# EAGLE design adc (EAGLE 9.3.0)
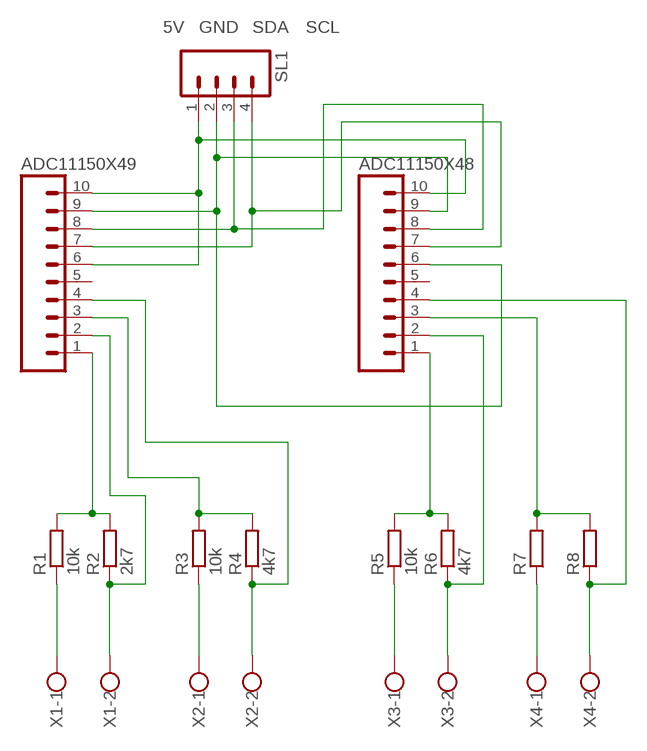
[diagram p0: schematic, sheet 1]

## Parts
ADC11150X48  M10  [10P]
ADC11150X49  M10  [10P]
R1  10k  R-EU_0204/7  [0204/7]
R2  2k7  R-EU_0204/7  [0204/7]
R3  10k  R-EU_0204/7  [0204/7]
R4  4k7  R-EU_0204/7  [0204/7]
R5  10k  R-EU_0204/7  [0204/7]
R6  4k7  R-EU_0204/7  [0204/7]
R7  R-EU_0204/7  [0204/7]
R8  R-EU_0204/7  [0204/7]
SL1  M04  [04P]
X1  W237-102  [W237-102]
X2  W237-102  [W237-102]
X3  W237-102  [W237-102]
X4  W237-102  [W237-102]

## Nets
5V: ADC11150X48.10 ADC11150X49.6 ADC11150X49.10 SL1.1
GND: ADC11150X48.6 ADC11150X48.9 ADC11150X49.9 SL1.2
N$1: ADC11150X48.1 R5.2 R6.2
N$2: R1.1 X1.1
N$3: ADC11150X48.2 R6.1 X3.2
N$4: ADC11150X48.3 R7.2 R8.2
N$5: R3.1 X2.1
N$6: ADC11150X48.4 R8.1 X4.2
N$7: R5.1 X3.1
N$8: R7.1 X4.1
N$9: ADC11150X49.1 R1.2 R2.2
N$10: ADC11150X49.2 R2.1 X1.2
N$13: ADC11150X49.3 R3.2 R4.2
N$14: ADC11150X49.4 R4.1 X2.2
SCL: ADC11150X48.7 ADC11150X49.7 SL1.4
SDA: ADC11150X48.8 ADC11150X49.8 SL1.3
Unconnected: ADC11150X48.5 ADC11150X49.5

## Library data of the parts
ADC11150X48 ADC11150X49 = con-amp-quick:M10: AMP QUICK CONNECTOR; OC_FARNELL: unknown; OC_NEWARK: unknown
R1-R8 = rcl:R-EU_: RESISTOR, European symbol; SPICEPREFIX: R
SL1 = con-amp-quick:M04: AMP QUICK CONNECTOR; OC_FARNELL: unknown; OC_NEWARK: unknown
X1-X4 = con-wago-500:W237-102: WAGO SCREW CLAMP; MPN: 237-102; OC_FARNELL: unknown; OC_NEWARK: 70K9898

## Board
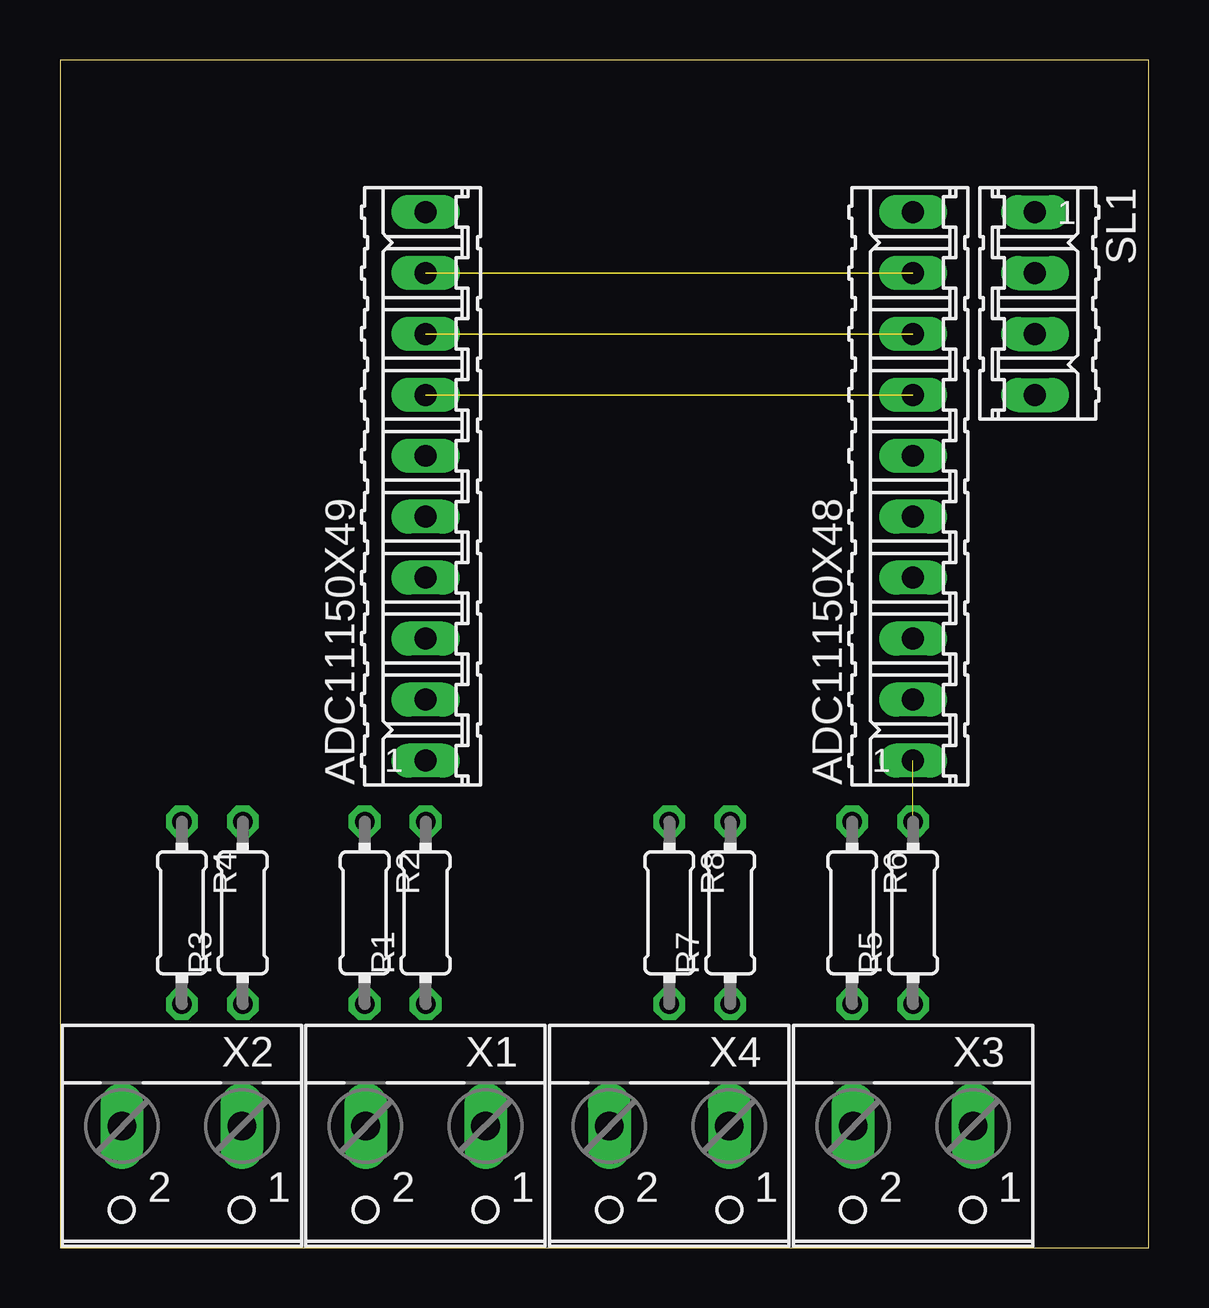
[diagram p1: board, top side]
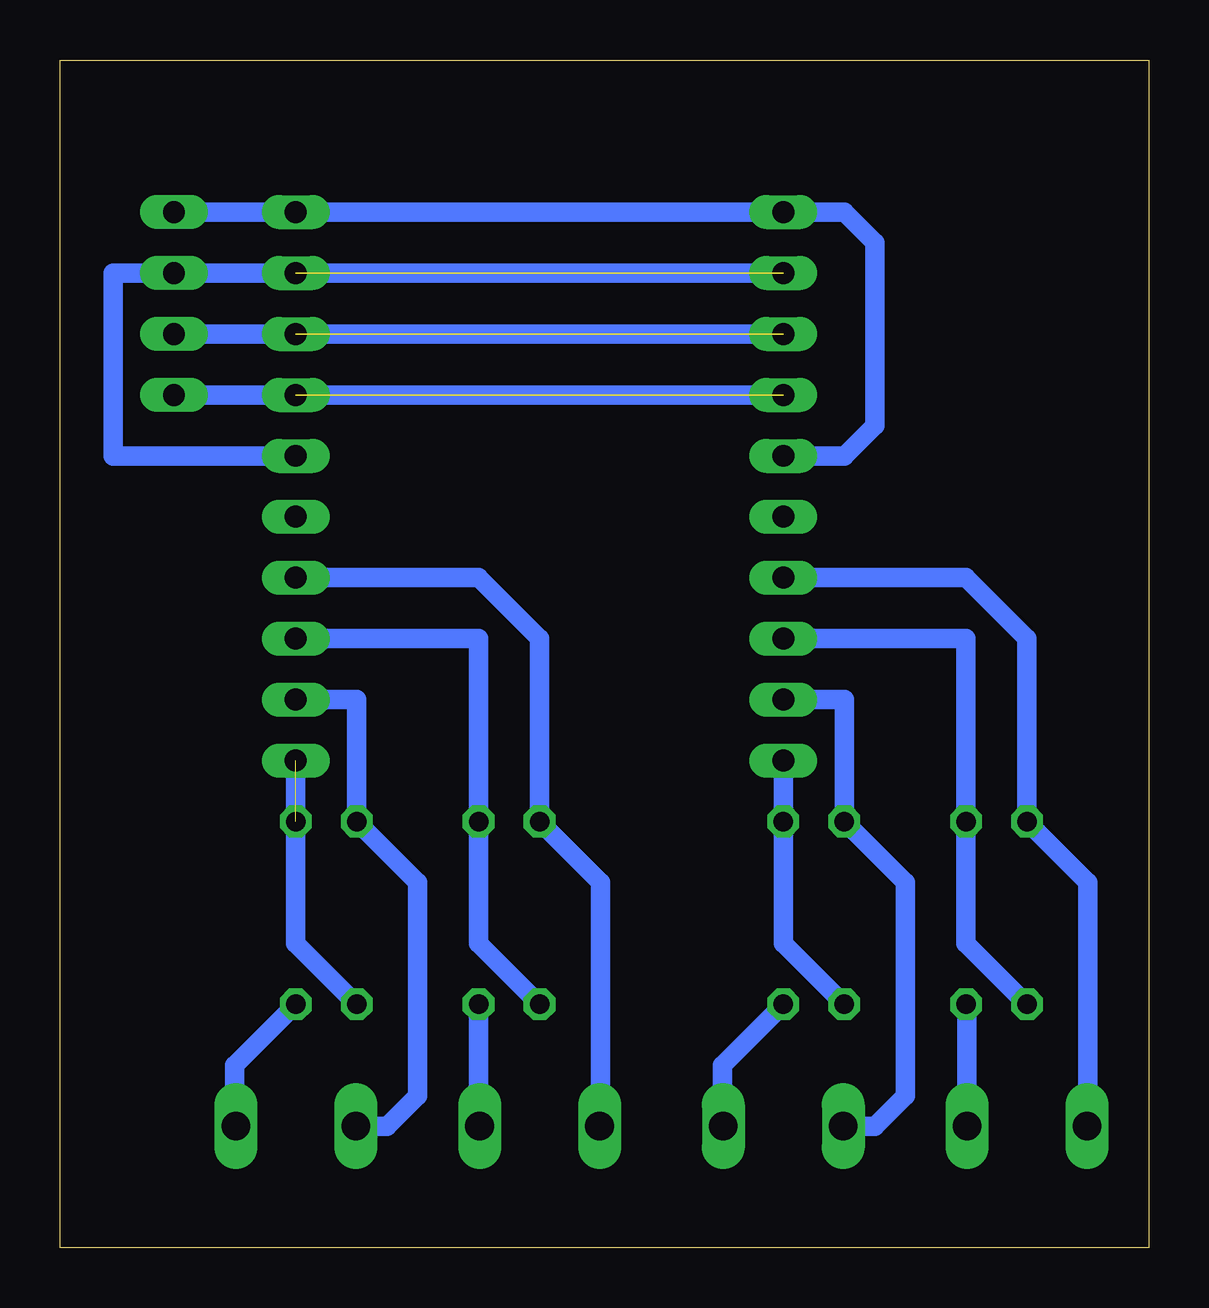
[diagram p2: board, bottom side, seen from below]

Size 45.39 x 49.52 mm. Coordinates in mm from the lower left corner, seen from the top.
Outline: 0,0 45.39,0 45.39,49.52 0,49.52 0,0
Copper layers (1*16): Top 0.035mm / dielectric 1.5mm / Bottom 0.035mm
Design rules "default": minimum track width 6mil, minimum drill 0.35mm, track to track 6mil, track to pad 6mil, pad to pad 6mil, via to via 6mil, smd to smd 6mil, copper to edge 40mil, drill to drill 6mil, minimum pad ring 10mil, minimum via ring 8mil, stop-mask expansion 4mil, vias tented up to drill 0mil, thermal gap 10mil

### Footprints (pad centres in the part's own frame; a part is rotated, then mirrored left to right if it is on the bottom)
10P = drill 0.914 long: 1 -11.43,0; 2 -8.89,0; 3 -6.35,0; 4 -3.81,0; 5 -1.27,0; 6 1.27,0; 7 3.81,0; 8 6.35,0; 9 8.89,0; 10 11.43,0
0204/7 = drill 0.813 octagon: 1 -3.81,0; 2 3.81,0
04P = drill 0.914 long: 1 -3.81,0; 2 -1.27,0; 3 1.27,0; 4 3.81,0
W237-102 = drill 1.194 long: 1 -2.5,-1.27; 2 2.5,-1.27

### Placement (x,y rotation side)
ADC11150X48  35.56,31.75 90 top
ADC11150X49  15.24,31.75 90 top
R1  15.24,13.97 90 top
R2  12.7,13.97 270 top
R3  7.62,13.97 90 top
R4  5.08,13.97 270 top
R5  35.56,13.97 90 top
R6  33.02,13.97 270 top
R7  27.94,13.97 90 top
R8  25.4,13.97 270 top
SL1  40.64,39.37 270 top
X1  15.24,3.81 180 top
X2  5.08,3.81 180 top
X3  35.56,3.81 180 top
X4  25.4,3.81 180 top

### Tracks (layer width: path | path; a pad name or v marks a point on that pad's centre or on a via)
5V
  Bottom 0.813: SL1.1 ADC11150X48.10 ADC11150X49.10 12.7,43.18 11.43,41.91 11.43,34.29 12.7,33.02 ADC11150X49.6
GND  (2 unrouted)
  Bottom 0.813: ADC11150X49.9 ADC11150X48.9 SL1.2 43.18,40.64 43.18,33.02 ADC11150X48.6
N$1  (1 unrouted)
  Bottom 0.813: R6.2 35.56,12.7 R5.2 ADC11150X48.1
N$2
  Bottom 0.813: R1.1 17.78,7.62 17.78,5.08 X1.1
N$3
  Bottom 0.813: ADC11150X48.2 33.02,22.86 R6.1 30.48,15.24 30.48,6.35 31.75,5.08 X3.2
N$4
  Bottom 0.813: R8.2 27.94,12.7 R7.2 27.94,25.4 ADC11150X48.3
N$5
  Bottom 0.813: R3.1 7.58,10.12 X2.1
N$6
  Bottom 0.813: ADC11150X48.4 27.94,27.94 25.4,25.4 R8.1 22.86,15.24 22.86,5.12 X4.2
N$7
  Bottom 0.813: R5.1 38.1,7.62 38.1,5.12 X3.1
N$8
  Bottom 0.813: R7.1 27.94,5.12 X4.1
N$9
  Bottom 0.813: R2.2 15.24,12.7 R1.2 ADC11150X49.1
N$10
  Bottom 0.813: ADC11150X49.2 12.7,22.86 R2.1 10.16,15.24 10.16,6.35 11.43,5.08 X1.2
N$13
  Bottom 0.813: R4.2 7.62,12.7 R3.2 7.62,25.4 ADC11150X49.3
N$14
  Bottom 0.813: ADC11150X49.4 7.62,27.94 5.08,25.4 R4.1 2.54,15.24 2.54,5.08 X2.2
SCL  (2 unrouted)
  Bottom 0.813: ADC11150X49.7 ADC11150X48.7 SL1.4
SDA  (2 unrouted)
  Bottom 0.813: ADC11150X49.8 ADC11150X48.8 SL1.3